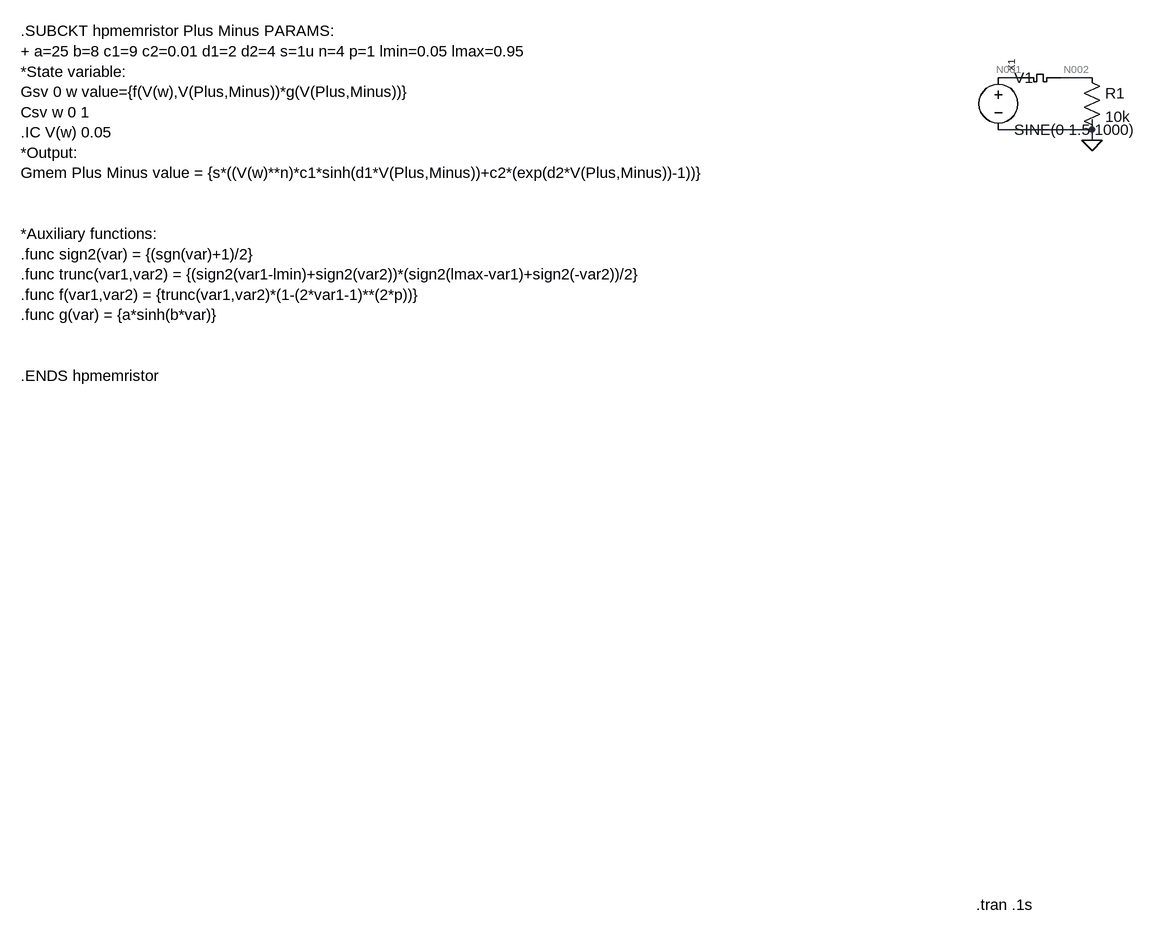
[diagram p0: schematic Draft1.asc]
Draft1.asc, the LTspice schematic file:
Version 4
SHEET 1 1104 1340
WIRE -480 -96 -512 -96
WIRE -368 -96 -416 -96
WIRE -368 -16 -368 -32
WIRE -368 -16 -512 -16
WIRE -368 0 -368 -16
FLAG -368 0 0
SYMBOL memristor1 -448 -96 R270
SYMATTR InstName X1
SYMATTR Value hpmemristor
SYMATTR Prefix X
SYMBOL voltage -512 -112 R0
WINDOW 123 0 0 Left 2
WINDOW 39 0 0 Left 2
SYMATTR InstName V1
SYMATTR Value SINE(0 1.5 1000)
SYMBOL res -384 -112 R0
SYMATTR InstName R1
SYMATTR Value 10k
TEXT -546 1176 Left 2 !.tran .1s
TEXT -2016 -168 Left 2 !.SUBCKT hpmemristor Plus Minus PARAMS:\n+ a=25 b=8 c1=9 c2=0.01 d1=2 d2=4 s=1u n=4 p=1 lmin=0.05 lmax=0.95\n*State variable:\nGsv 0 w value={f(V(w),V(Plus,Minus))*g(V(Plus,Minus))}\nCsv w 0 1\n.IC V(w) 0.05\n*Output:\nGmem Plus Minus value = {s*((V(w)**n)*c1*sinh(d1*V(Plus,Minus))+c2*(exp(d2*V(Plus,Minus))-1))}\n \n \n*Auxiliary functions:\n.func sign2(var) = {(sgn(var)+1)/2}\n.func trunc(var1,var2) = {(sign2(var1-lmin)+sign2(var2))*(sign2(lmax-var1)+sign2(-var2))/2}\n.func f(var1,var2) = {trunc(var1,var2)*(1-(2*var1-1)**(2*p))}\n.func g(var) = {a*sinh(b*var)}\n \n \n.ENDS hpmemristor

The netlist it stands for:
* Draft1.asc
XX1 N001 N002 memristor1 params: hpmemristor  ; pins Plus Minus
V1 N001 0 SINE(0 1.5 1000)
R1 N002 0 10k
.tran .1s
.SUBCKT hpmemristor Plus Minus PARAMS:
+ a=25 b=8 c1=9 c2=0.01 d1=2 d2=4 s=1u n=4 p=1 lmin=0.05 lmax=0.95
*State variable:
Gsv 0 w value={f(V(w),V(Plus,Minus))*g(V(Plus,Minus))}
Csv w 0 1
.IC V(w) 0.05
*Output:
Gmem Plus Minus value = {s*((V(w)**n)*c1*sinh(d1*V(Plus,Minus))+c2*(exp(d2*V(Plus,Minus))-1))}
*Auxiliary functions:
.func sign2(var) = {(sgn(var)+1)/2}
.func trunc(var1,var2) = {(sign2(var1-lmin)+sign2(var2))*(sign2(lmax-var1)+sign2(-var2))/2}
.func f(var1,var2) = {trunc(var1,var2)*(1-(2*var1-1)**(2*p))}
.func g(var) = {a*sinh(b*var)}
.ENDS hpmemristor
.backanno
.end

* Results of the author's LTspice run, read from the files saved beside the schematic
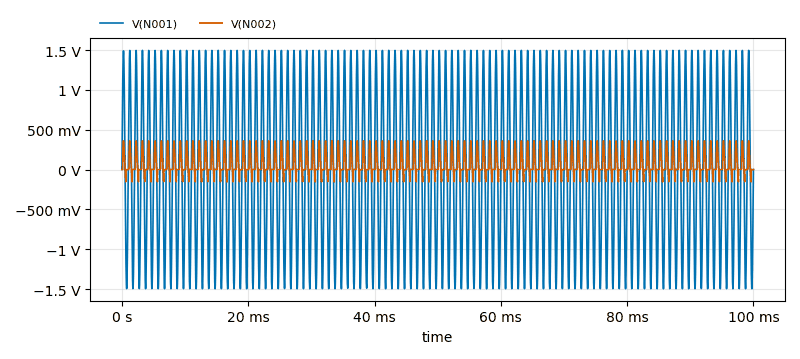
[diagram p1: Transient Analysis of Draft1.asc, plotted from the saved traces]
* Transient Analysis, 1 run:
*   V(N001): min -1.496 V, max 1.496 V, average 353.3 µV, rms 1.052 V, last 0 V
*   V(N002): min -155.4 mV, max 361.7 mV, average 75.1 mV, rms 161.7 mV, last 0 V